# EAGLE design BareBonesArduino (EAGLE 7.4.0)
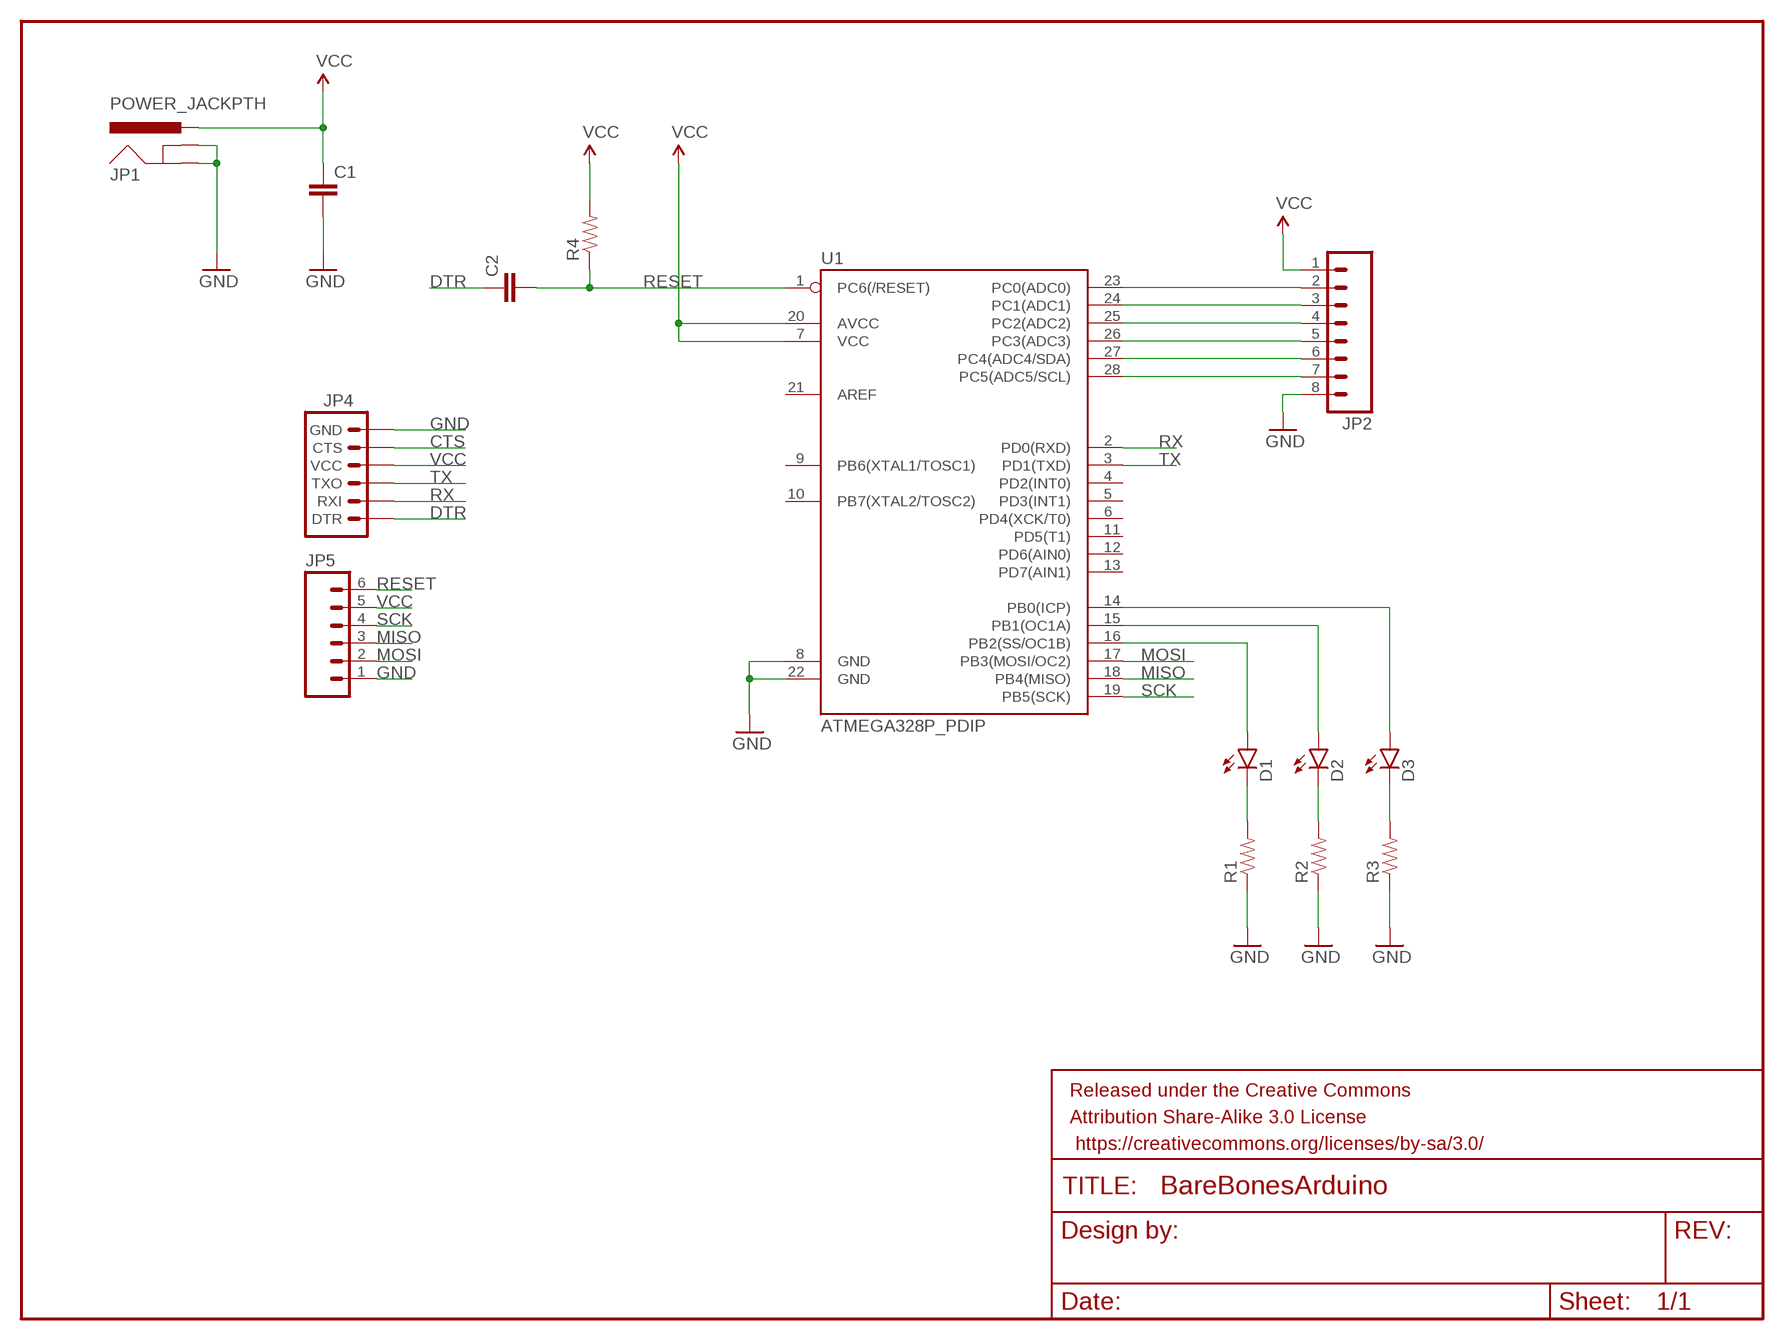
[diagram p0: schematic, sheet 1]

## Parts
C1  CAPPTH  [CAP-PTH-SMALL]
C2  CAPPTH  [CAP-PTH-SMALL]
D1  LED5MM  [LED5MM]
D2  LED5MM  [LED5MM]
D3  LED5MM  [LED5MM]
FRAME1  FRAME-LETTER  [CREATIVE_COMMONS]
JP1  POWER_JACKPTH  [POWER_JACK_PTH]
JP2  M08  [1X08_ROUND]
JP4  ARDUINO_SERIAL_PROGRAMPTH  [1X06]
JP5  M06SILK_FEMALE_PTH  [1X06]
R1  RESISTORPTH-1/4W  [AXIAL-0.4]
R2  RESISTORPTH-1/4W  [AXIAL-0.4]
R3  RESISTORPTH-1/4W  [AXIAL-0.4]
R4  RESISTORPTH-1/4W  [AXIAL-0.4]
U1  ATMEGA328P_PDIP  [DIL28-3]

## Nets
CTS: JP4.5(CTS)
DTR: C2.1 JP4.1(DTR)
GND: C1.2 JP1.GND JP1.GNDBREAK JP2.8 JP4.6(GND) JP5.1 R1.P$1 R2.P$1 R3.P$1 U1.8(GND) U1.22(GND)
MISO: JP5.3 U1.18(PB4(MISO))
MOSI: JP5.2 U1.17(PB3(MOSI/OC2))
N$2: D1.K(C) R1.P$2
N$3: D2.K(C) R2.P$2
N$4: D3.K(C) R3.P$2
N$5: D3.A U1.14(PB0(ICP))
N$6: D2.A U1.15(PB1(OC1A))
N$7: D1.A U1.16(PB2(SS/OC1B))
N$8: JP2.2 U1.23(PC0(ADC0))
N$9: JP2.3 U1.24(PC1(ADC1))
N$10: JP2.4 U1.25(PC2(ADC2))
N$11: JP2.5 U1.26(PC3(ADC3))
N$12: JP2.6 U1.27(PC4(ADC4/SDA))
N$13: JP2.7 U1.28(PC5(ADC5/SCL))
RESET: C2.2 JP5.6 R4.P$1 U1.1(PC6(/RESET))
RX: JP4.2(RXI) U1.2(PD0(RXD))
SCK: JP5.4 U1.19(PB5(SCK))
TX: JP4.3(TXO) U1.3(PD1(TXD))
VCC: C1.1 JP1.PWR JP2.1 JP4.4(VCC) JP5.5 R4.P$2 U1.7(VCC) U1.20(AVCC)
Unconnected: U1.4(PD2(INT0)) U1.5(PD3(INT1)) U1.6(PD4(XCK/T0)) U1.9(PB6(XTAL1/TOSC1)) U1.10(PB7(XTAL2/TOSC2)) U1.11(PD5(T1)) U1.12(PD6(AIN0)) U1.13(PD7(AIN1)) U1.21(AREF)

## Library data of the parts
C1 C2 = SparkFun-Capacitors:CAP: Capacitor Standard 0603 ceramic capacitor, and 0.1" leaded capacitor.
D1-D3 = SparkFun-LED:LED: LEDs Standard schematic elements and footprints for 5mm, 3mm, 1206, and 0603 sized LEDs. 5mm - Spark Fun Electronics SKU : COM-00529 (and others)
FRAME1 = SparkFun-Retired:FRAME-LETTER: Schematic Frame Standard 8.5x11 US Letter frame
JP1 = SparkFun-Connectors:POWER_JACK: Power Jack This is the standard 5.5mm barrel jack for power. The PTH is the most common, proven, reliable, footprint. The Slot footprint only works if the mill layer is transmitted to the PCB fab house so be warned. Mating wall wart : TOL-00298 (and others); PROD_ID: CONN-08197
JP2 = SparkFun-Connectors:M08: Header 8 Standard 8-pin 0.1" header. Use with straight break away headers (SKU : PRT-00116), right angle break away headers (PRT-00553), swiss pins (PRT-00743), machine pins (PRT-00117), and female headers (PRT-00115).
JP4 = SparkFun-Connectors:ARDUINO_SERIAL_PROGRAM: FTDI connector footprints
JP5 = SparkFun-Connectors:M06: Header 6 Standard 6-pin 0.1" header. Use with straight break away headers (SKU : PRT-00116), right angle break away headers (PRT-00553), swiss pins (PRT-00743), machine pins (PRT-00117), and female headers (PRT-00115). Molex polarized connector foot print use with SKU : PRT-08094 with associated crimp pins and housings. NOTES ON THE VARIANTS LOCK and LOCK_LONGPADS... This footprint was designed to help hold the alignment of a through-hole component (i.e. 6-pin header) while soldering it into place. You may notice that each hole has been shifted either up or down by 0.005 of an inch from it's more standard position (which is a perfectly straight line). This slight alteration caused the pins (the squares in the middle) to touch the edges of the holes. Because they are alternating, it causes a "brace" to hold the component in place. 0.005 has proven to be the perfect amount of "off-center" position when using our standard breakaway headers. Although looks a little odd when you look at the bare footprint, once you have a header in there, the alteration is very hard to notice. Also,if you push a header all the way into place, it is covered up entirely on the bottom side. This idea of altering the position of holes to aid alignment will be further integrated into the Sparkfun Library for other footprints. It can help hold any component with 3 or more connection pins.; PROD_ID: CONN-08437
R1-R4 = SparkFun-Resistors:RESISTOR: Resistor Basic schematic elements and footprints for 0603, 1206, and PTH resistors.
U1 = SparkFun-DigitalIC:ATMEGA328P_PDIP: uC used in the Arduino 32kb flash, 1k EEPROM, 2k SRAM This is the through-hole version of this chip.

## Board
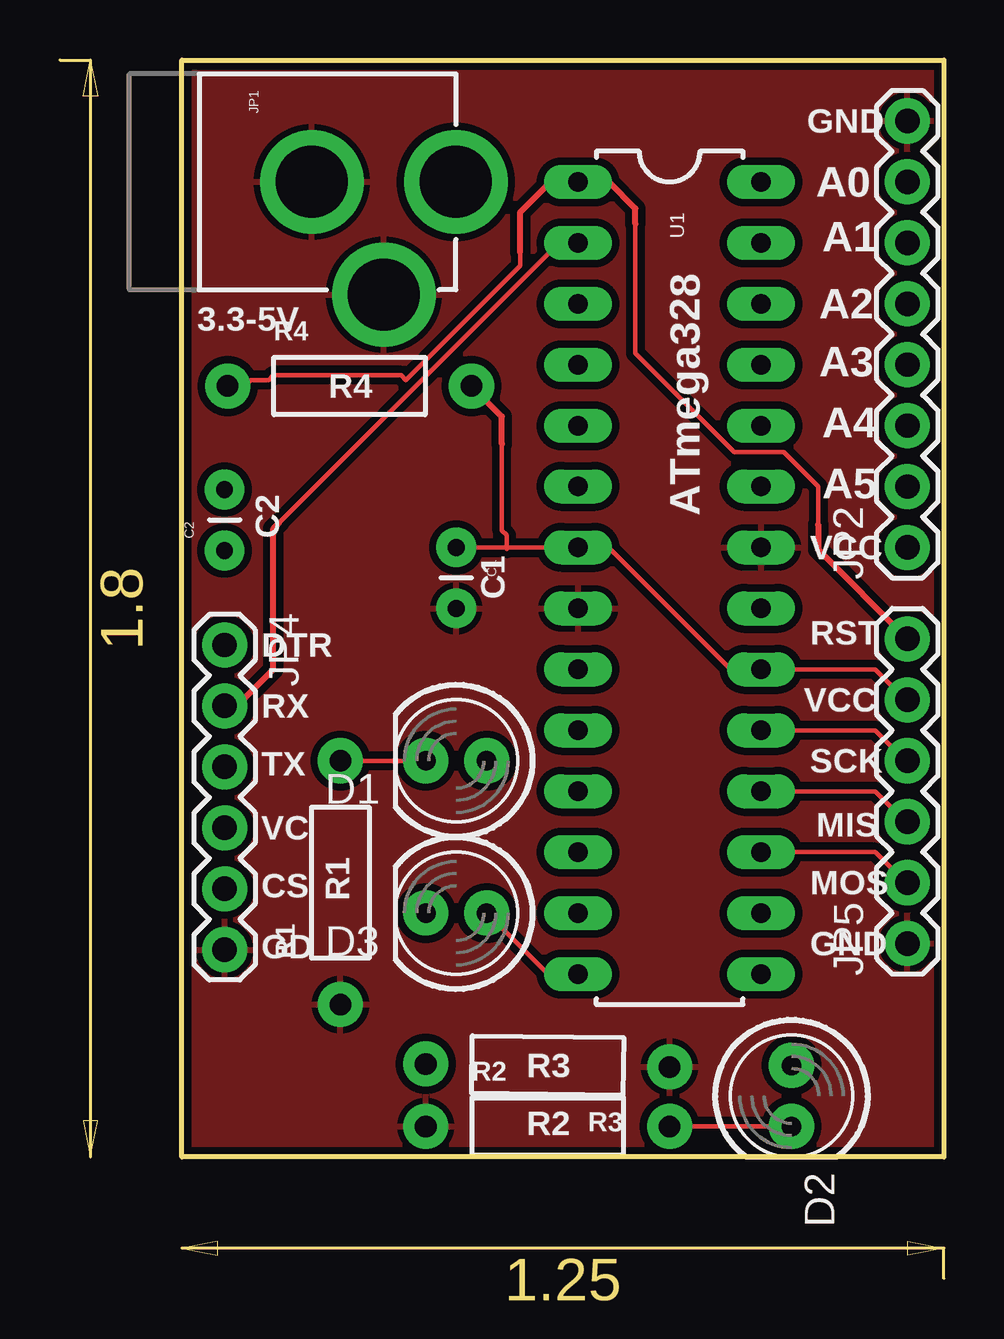
[diagram p1: board, top side]
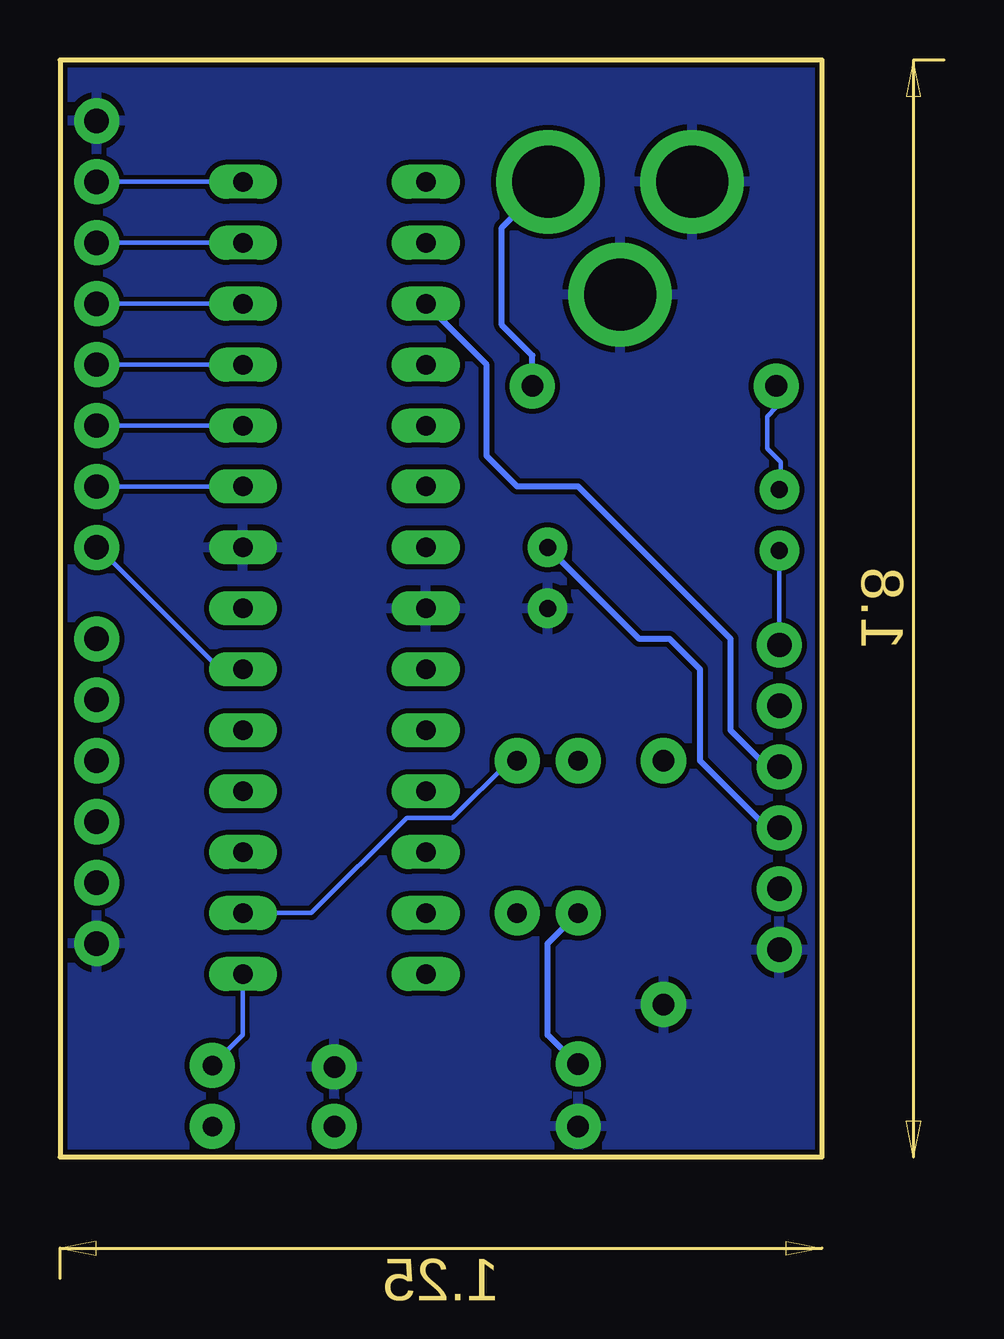
[diagram p2: board, bottom side, seen from below]

Size 31.75 x 45.72 mm. Coordinates in mm from the lower left corner, seen from the top.
Outline: 0,0 0,45.72 31.75,45.72 31.75,0 0,0
Copper layers (1*16): Top 0.035mm / dielectric 1.5mm / Bottom 0.035mm
Design rules "SparkFun-2-layer": minimum track width 7mil, minimum drill 15mil, track to track 8mil, track to pad 8mil, pad to pad 8mil, via to via 8mil, smd to smd 8mil, copper to edge 8mil, drill to drill 8mil, minimum pad ring 12mil, minimum via ring 10mil, stop-mask expansion 4mil, vias tented up to drill 20mil, thermal gap 10mil

### Footprints (pad centres in the part's own frame; a part is rotated, then mirrored left to right if it is on the bottom)
CAP-PTH-SMALL = drill 0.7 pad 1.651: 1 0,0; 2 2.54,0
LED5MM = drill 0.813 pad 1.88: A -1.27,0; K 1.27,0
POWER_JACK_PTH = drill 2.997 pad 4.318: GND 0,7.7; GNDBREAK 4.7,10.7; PWR 0,13.7
1X08_ROUND = drill 1.016 pad 1.88: 1 0,0; 2 2.54,0; 3 5.08,0; 4 7.62,0; 5 10.16,0; 6 12.7,0; 7 15.24,0; 8 17.78,0
1X06 = drill 1.016 pad 1.88: 1 0,0; 2 2.54,0; 3 5.08,0; 4 7.62,0; 5 10.16,0; 6 12.7,0
AXIAL-0.4 = drill 0.9 pad 1.88: P$1 -5.08,0; P$2 5.08,0
DIL28-3 = drill 0.813 long: 1 -16.51,-3.81; 2 -13.97,-3.81; 3 -11.43,-3.81; 4 -8.89,-3.81; 5 -6.35,-3.81; 6 -3.81,-3.81; 7 -1.27,-3.81; 8 1.27,-3.81; 9 3.81,-3.81; 10 6.35,-3.81; 11 8.89,-3.81; 12 11.43,-3.81; 13 13.97,-3.81; 14 16.51,-3.81; 15 16.51,3.81; 16 13.97,3.81; 17 11.43,3.81; 18 8.89,3.81; 19 6.35,3.81; 20 3.81,3.81; 21 1.27,3.81; 22 -1.27,3.81; 23 -3.81,3.81; 24 -6.35,3.81; 25 -8.89,3.81; 26 -11.43,3.81; 27 -13.97,3.81; 28 -16.51,3.81

### Placement (x,y rotation side)
C1  11.43,25.4 270 top
C2  1.78,25.27 90 top
D1  11.43,16.51 180 top
D2  25.4,2.54 270 top
D3  11.43,10.16 180 top
FRAME1  -81.28,7.62 0 top  (outside the outline)
JP1  -2.29,40.64 270 top
JP2  30.23,25.4 90 top
JP4  1.78,21.34 270 top
JP5  30.23,8.89 90 top
R1  6.6,11.43 90 top
R2  15.24,1.27 0 top
R3  15.24,3.81 179.3 top
R4  6.98,32.13 0 top
U1  20.32,24.13 270 top

### Tracks (layer width: path | path; a pad name or v marks a point on that pad's centre or on a via)
DTR
  Bottom 0.178: JP4.1 C2.1
GND
  pour Top (isolate 0.305): 0,45.72 31.75,45.72 31.75,0 0,0
  pour Bottom: 0,45.72 31.75,45.72 31.75,0 0,0
MISO
  Top 0.178: U1.18 28.89,15.24 30.16,13.97 JP5.3
MOSI
  Top 0.178: U1.17 28.89,12.7 30.16,11.43 JP5.2
N$2
  Top 0.178: D1.K R1.P$2
N$3
  Top 0.178: D2.K R2.P$2
N$4
  Bottom 0.254: R3.P$2 10.22,3.87 11.43,5.08 11.43,8.89 D3.K
N$5
  Top 0.178: U1.14 15.24,7.62 D3.A
N$6
  Bottom 0.178: U1.15 24.13,5.08 D2.A
N$7
  Bottom 0.178: U1.16 21.27,10.16 17.3,14.13 15.4,14.13 13.02,16.51 D1.A
N$8
  Bottom 0.178: JP2.2 U1.23
N$9
  Bottom 0.178: JP2.3 U1.24
N$10
  Bottom 0.178: JP2.4 U1.25
N$11
  Bottom 0.178: JP2.5 U1.26
N$12
  Bottom 0.178: JP2.6 U1.27
N$13
  Bottom 0.178: JP2.7 U1.28
RESET
  Top 0.178: 26.51,26.35 26.51,27.94 25.08,29.37 23.02,29.37 18.89,33.5 18.89,38.89 | 14.1,37.72 14.1,37.15 9.33,32.38 9.14,32.57 3.81,32.57 3.62,32.38 2.86,32.38 2.67,32.19 1.9,32.19 R4.P$1
  Top 0.254: 26.51,26.35 26.51,25.3 JP5.6 | 14.1,37.72 14.1,39.37 15.37,40.64 U1.1 17.78,40.64 18.89,39.53 18.89,38.89
  Bottom 0.178: R4.P$1 1.9,31.24 2.29,30.86 2.29,29.53 1.71,28.96 1.71,27.81 C2.2
RX
  Top 0.178: U1.2 15.72,38.1 4.05,26.43
  Top 0.254: 4.05,26.43 3.81,26.19 3.81,20.32 2.29,18.8 JP4.2
SCK
  Top 0.178: U1.19 28.89,17.78 30.16,16.51 JP5.4
TX
  Bottom 0.254: JP4.3 2.29,16.26 3.81,17.78 3.81,21.59 10.16,27.94 12.7,27.94 13.97,29.21 13.97,33.02 U1.3
VCC
  Top 0.178: JP5.5 30.16,19.05 28.89,20.32 U1.20 22.86,20.32 17.78,25.4 U1.7 13.53,25.4 | 13.53,25.4 C1.1 11.59,25.4 | 13.33,29.72 13.33,26.1 13.53,25.91 13.53,25.4 | 13.53,25.34 13.53,25.4
  Top 0.254: 13.33,29.72 13.33,30.86 R4.P$2
  Bottom 0.178: U1.20 25.08,20.32 30.16,25.4 JP2.1
  Bottom 0.254: R4.P$2 12.06,33.4 13.33,34.67 13.33,38.74 12.7,39.37 12.68,39.37 JP1.PWR | JP4.4 2.29,13.72 5.08,16.51 5.08,20.32 6.35,21.59 7.62,21.59 C1.1

### Text on the board
tPlace: GND | A0 | A1 | ATmega328 | 3.3-5V | A2 | A3 | R4 | A4 | A5 | C2 | VCC | C1 | RST | DTR | RX | VCC | TX | SCK | MIS | VC | CS | R1 | MOS | GD | GND | R3 | R2